# EAGLE design attiny45 (EAGLE 7.6.0)
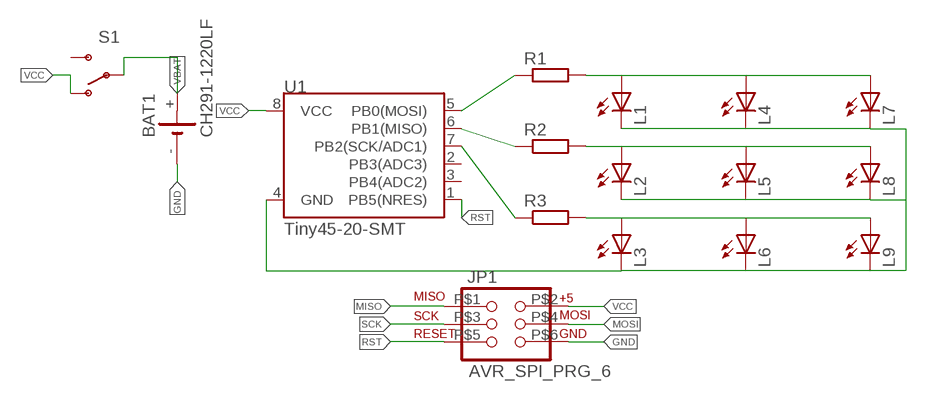
[diagram p0: schematic, sheet 1]

## Parts
BAT1  CH291-1220LF  [CH291-1220LF]
JP1  AVR_SPI_PRG_6  [2X3_SMD_PAD]
L1  LEDSML1206  [SML1206]
L2  LEDSML1206  [SML1206]
L3  LEDSML1206  [SML1206]
L4  LEDSML1206  [SML1206]
L5  LEDSML1206  [SML1206]
L6  LEDSML1206  [SML1206]
L7  LEDSML1206  [SML1206]
L8  LEDSML1206  [SML1206]
L9  LEDSML1206  [SML1206]
R1  R-EU_M0805  [M0805]
R2  R-EU_M0805  [M0805]
R3  R-EU_M0805  [M0805]
S1  SWITCH-SPDT-SMD-A  [SWITCH-SPST-SMD-A]
U1  Tiny45-20-SMT  ATTINY45TINY45-20-SMT  [SO08-EIAJ]

## Nets
GND: BAT1.- JP1.P$6 L1.C L2.C L3.C L4.C L5.C L6.C L7.C L8.C L9.C U1.4(GND)
MISO: JP1.P$1 R2.1 U1.6(PB1(MISO))
MOSI: JP1.P$4 R1.1 U1.5(PB0(MOSI))
N$1: L1.A L4.A L7.A R1.2
N$3: L2.A L5.A L8.A R2.2
N$5: L3.A L6.A L9.A R3.2
RST: JP1.P$5 U1.1(PB5(NRES))
SCK: JP1.P$3 R3.1 U1.7(PB2(SCK/ADC1))
VBAT: BAT1.+ S1.2(P)
VCC: JP1.P$2 S1.1(O) U1.8(VCC)
Unconnected: S1.3(S) U1.2(PB3(ADC3)) U1.3(PB4(ADC2))

## Library data of the parts
BAT1 = battery:CH291-1220LF: Battery Holder, SMT, 12mm multicomp PART NO. CH291-1220LF Source: Data sheet <http://www.farnell.com/datasheets/1505860.pdf>
JP1 = SparkFun-Connectors:AVR_SPI_PRG_6: AVR ISP 6 Pin This is the reduced ISP connector for AVR programming. Common on Arduino. This footprint will take up less PCB space and can be used with a 10-pin to 6-pin adapter such as SKU: BOB-08508 **Special note about "TEST_POINT" package. The stop mask is on the top side, so if you want your programming test points to be on the bottom of your board, make sure to place this package on the bottom side of the board. This also ensure that the orientation to program from the bottom side will be correct.
L1-L9 = led:LED: LED OSRAM: - CHIPLED LG R971, LG N971, LY N971, LG Q971, LY Q971, LO R971, LY R971 LH N974, LH R974 LS Q976, LO Q976, LY Q976 LO Q996 - Hyper CHIPLED LW Q18S LB Q993, LB Q99A, LB R99A - SideLED LS A670, LO A670, LY A670, LG A670, LP A670 LB A673, LV A673, LT A673, LW A673 LH A674 LY A675 LS A676, LA A676, LO A676, LY A676, LW A676 LS A679, LY A679, LG A679 - Hyper Micro SIDELED® LS Y876, LA Y876, LO Y876, LY Y876 LT Y87S - SmartLED LW L88C, LW L88S LB L89C, LB L89S, LG L890 LS L89K, LO L89K, LY L89K LS L896, LA L896, LO L896, LY L896 - TOPLED LS T670, LO T670, LY T670, LG T670, LP T670 LSG T670, LSP T670, LSY T670, LOP T670, LYG T670 LG T671, LOG T671, LSG T671 LB T673, LV T673, LT T673, LW T673 LH T674 LS T676, LA T676, LO T676, LY T676, LB T676, LH T676, LSB T676, LW T676 LB T67C, LV T67C, LT T67C, LS T67K, LO T67K, LY T67K, LW E67C LS E67B, LA E67B, LO E67B, LY E67B, LB E67C, LV E67C, LT E67C LW T67C LS T679, LY T679, LG T679 LS T770, LO T770, LY T770, LG T770, LP T770 LB T773, LV T773, LT T773, LW T773 LH T774 LS E675, LA E675, LY E675, LS T675 LS T776, LA T776, LO T776, LY T776, LB T776 LHGB T686 LT T68C, LB T68C - Hyper Mini TOPLED® LB M676 - Mini TOPLED Santana® LG M470 LS M47K, LO M47K, LY M47K Source: http://www.osram.convergy.de LUXEON: - LUMILED® LXK2-PW12-R00, LXK2-PW12-S00, LXK2-PW14-U00, LXK2-PW14-V00 LXK2-PM12-R00, LXK2-PM12-S00, LXK2-PM14-U00 LXK2-PE12-Q00, LXK2-PE12-R00, LXK2-PE12-S00, LXK2-PE14-T00, LXK2-PE14-U00 LXK2-PB12-K00, LXK2-PB12-L00, LXK2-PB12-M00, LXK2-PB14-N00, LXK2-PB14-P00, LXK2-PB14-Q00 LXK2-PR12-L00, LXK2-PR12-M00, LXK2-PR14-Q00, LXK2-PR14-R00 LXK2-PD12-Q00, LXK2-PD12-R00, LXK2-PD12-S00 LXK2-PH12-R00, LXK2-PH12-S00 LXK2-PL12-P00, LXK2-PL12-Q00, LXK2-PL12-R00 Source: www.luxeon.com KINGBRIGHT: KA-3528ASYC Source: www.kingbright.com
R1-R3 = rcl:R-EU_: RESISTOR, European symbol
S1 = SparkFun-Electromechanical:SWITCH-SPDT: SPDT Switch Simple slide switch, Spark Fun Electronics SKU : COM-00102 DPDT SMT slide switch, AYZ0202, SWCH-08179
U1 = SparkFun-DigitalIC:ATTINY45: Atmel 8-pin 2/4/8kB flash uC; PROD_ID: IC-08922

## Board
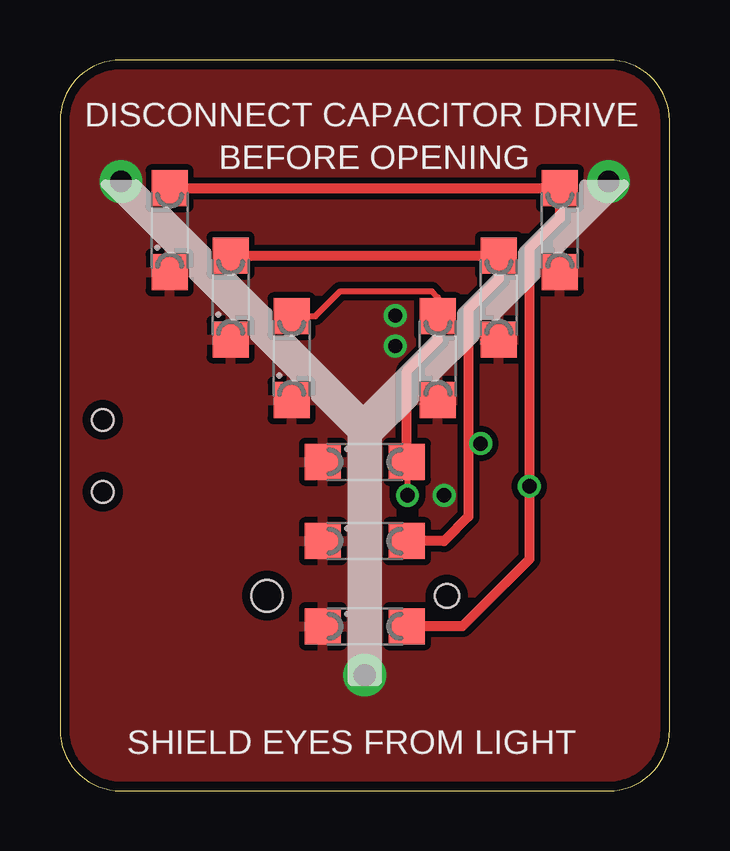
[diagram p1: board, top side]
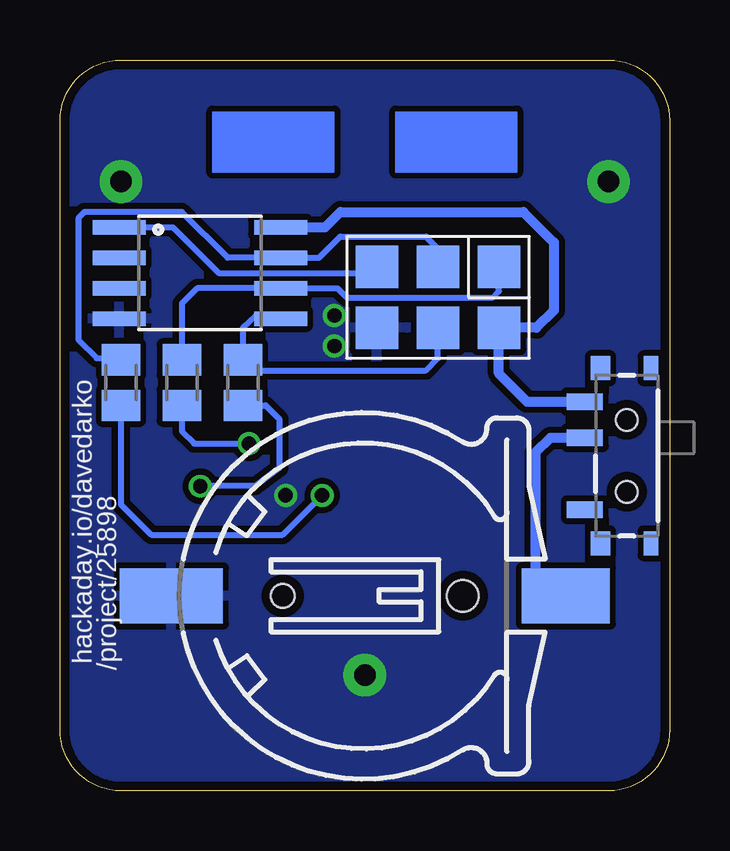
[diagram p2: board, bottom side, seen from below]

Size 25.4 x 30.47 mm. Coordinates in mm from the lower left corner, seen from the top.
Outline: 0,27.93 0,2.54 arc90 2.54,0 22.86,0 arc90 25.4,2.54 25.4,27.93 arc90 22.86,30.47 2.54,30.47 arc90 0,27.93
Copper layers (1*16): Top 0.0356mm / dielectric 1.5011mm / Bottom 0.0356mm
Design rules "LaenPCBOrder *": minimum track width 6mil, minimum drill 13mil, track to track 6mil, track to pad 6mil, pad to pad 6mil, via to via 6mil, smd to smd 6mil, copper to edge 15mil, drill to drill 6mil, minimum pad ring 7mil, minimum via ring 7mil, stop-mask expansion 3mil, vias tented up to drill 35mil, thermal gap 10mil

### Footprints (pad centres in the part's own frame; a part is rotated, then mirrored left to right if it is on the bottom)
CH291-1220LF = smd 2.3 x 3.66: + 0,-2.296 | smd 2.3 x 4.3: - 0,14.146 | hole 1.3: 0,2 | hole 1: 0,9.5
2X3_SMD_PAD = smd 1.778 x 1.778: P$1 -1.27,2.54; P$2 1.27,2.54; P$3 -1.27,0; P$4 1.27,0; P$5 -1.27,-2.54; P$6 1.27,-2.54
SML1206 = smd 1.5 x 1.5: A 1.75,0; C -1.75,0
M0805 = smd 1.3 x 1.6: 1 -0.95,0; 2 0.95,0
SWITCH-SPST-SMD-A = smd 0.7 x 1.5: 1 -2.25,-1.75; 2 -0.75,-1.75; 3 2.25,-1.75 | smd 1 x 0.6: GND1 -3.65,1; GND3 3.65,1 | smd 1 x 0.8: GND2 -3.65,-1.1; GND4 3.65,-1.1 | hole 0.9: -1.5,0; 1.5,0
SO08-EIAJ = smd 0.61 x 2.21: 1 -1.905,-3.378; 2 -0.635,-3.378; 3 0.635,-3.378; 4 1.905,-3.378; 5 1.905,3.353; 6 0.635,3.353; 7 -0.635,3.353; 8 -1.905,3.353

### Placement (x,y rotation side)
BAT1  6.62,8.13 90 bottom
JP1  9.65,20.57 270 bottom
L1  4.57,23.37 90 top
L2  7.11,20.57 90 top
L3  9.65,18.03 90 top
L4  20.83,23.37 90 top
L5  18.29,20.57 90 top
L6  15.75,18.03 90 top
L7  12.7,6.86 0 top
L8  12.7,10.41 0 top
L9  12.7,13.72 0 top
R1  17.78,17.02 270 bottom
R2  20.32,17.02 270 bottom
R3  22.86,17.02 270 bottom
S1  1.78,13.97 270 bottom
U1  19.56,21.59 270 bottom

### Tracks (layer width: path | path; a pad name or v marks a point on that pad's centre or on a via)
GND  (via drill 0.6, 0.9 pad 1.78)
  other vias: 2.54,25.4 22.86,25.4 12.7,4.83 13.97,18.54 13.97,19.81 16,12.32
  pour Top (isolate 0.254): -2.54,35.56 27.94,35.56 27.94,-5.08 -2.54,-5.08
  pour Bottom (isolate 0.254): -5.08,33.02 30.48,33.02 30.48,-2.54 -5.08,-2.54
MISO
  Bottom 0.254: JP1.P$1 7.11,20.83 7.37,20.57 13.46,20.57 13.84,20.95 U1.6 19.68,20.95 20.32,20.32 R2.1
MOSI
  Bottom 0.254: JP1.P$4 9.65,18.03 10.16,17.53 17.59,17.53 R1.1 17.78,19.3 17.26,19.8 16.46,19.8 U1.5
N$1  (via drill 0.6)
  Top 0.406: L1.A L4.A 20.83,23.88 19.56,22.61 v19.56,12.7 19.56,9.65 16.76,6.86 L7.A
  Bottom 0.254: R1.2 16.83,16.07 16.26,15.49 16.26,13.46 17.27,12.7 v19.56,12.7
N$3  (via drill 0.6)
  Top 0.254: v17.53,14.48 17.27,14.48 17.02,14.73
  Top 0.406: L2.A L5.A 18.29,21.34 17.02,20.07 17.02,14.73 17.02,11.43 16,10.41 L8.A
  Bottom 0.254: R2.2 20.32,14.99 19.81,14.48 v17.53,14.48
N$5  (via drill 0.6)
  Top 0.254: 14.48,13.72 L9.A 14.48,13.69 v14.48,12.32 | L3.A 10.64,19.78 11.68,20.83 15.49,20.83 15.75,20.57 L6.A
  Top 0.406: L9.A 14.45,17.5 15.75,18.8 L6.A
  Bottom 0.254: R3.2 22.86,11.94 21.59,10.67 16.13,10.67 v14.48,12.32
RST
  Bottom 0.254: U1.1 20.7,23.49 18.8,21.59 12.45,21.59
  Bottom 0.406: 12.45,21.59 JP1.P$5
SCK
  Bottom 0.254: JP1.P$3 9.65,22.61 10.16,23.11 13.72,23.11 14.61,22.22 U1.7 18.41,22.22 20.32,24.13 24.38,24.13 24.64,23.88 24.64,18.8 23.88,18.03 22.93,18.03 R3.1
VBAT
  Bottom 0.406: S1.2 4.96,14.72 5.59,14.1 5.59,8.51 5.21,8.13 BAT1.+
VCC
  Bottom 0.406: U1.8 14.35,23.49 13.72,24.13 6.1,24.13 4.83,22.86 4.83,20.03 5.55,19.3 JP1.P$2 7.11,17.4 5.93,16.22 S1.1
(copper drawn outside any net)
  shapes: Bottom area x2

### Text on the board
tNames: DISCONNECT CAPACITOR DRIVE | BEFORE OPENING | SHIELD EYES FROM LIGHT
bNames: hackaday.io/davedarko | /project/25898